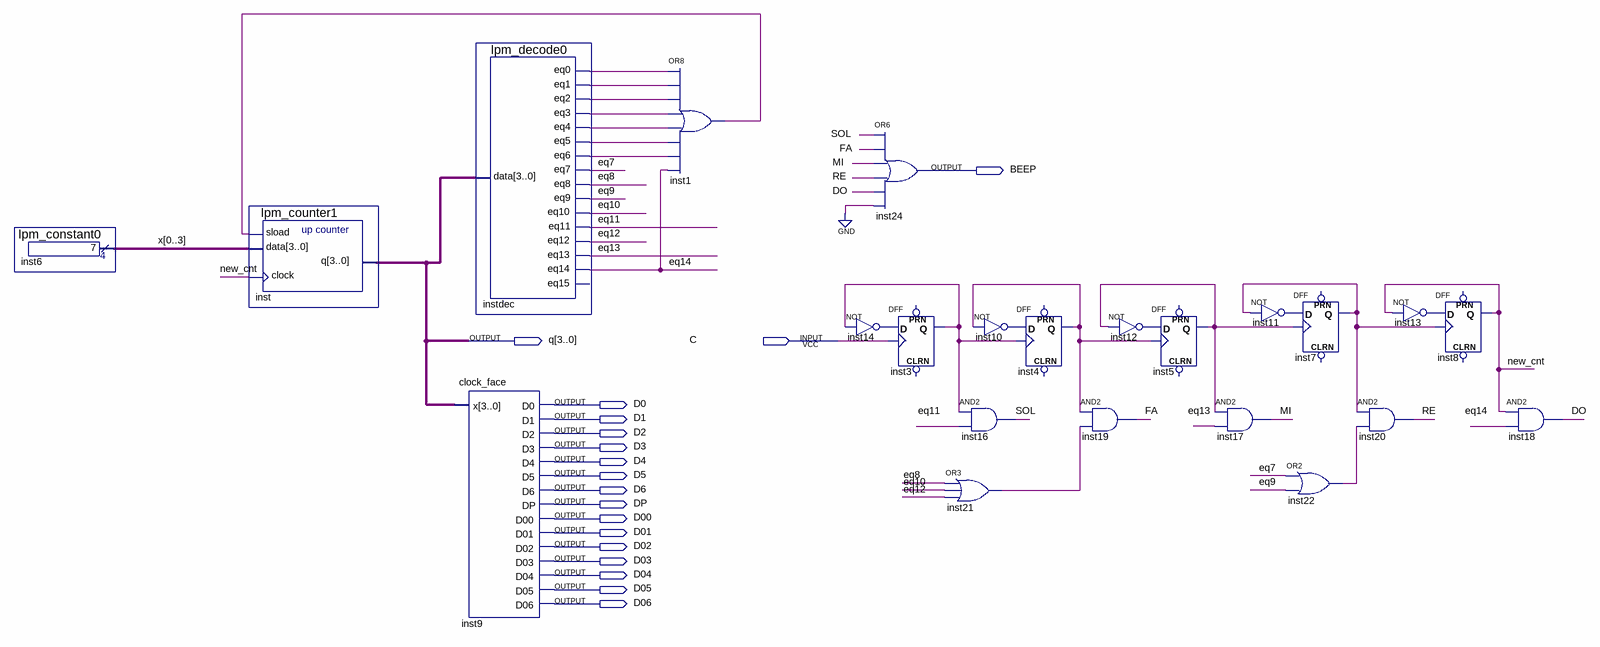
[diagram p0: schematic sheet]
// Quartus schematic 7.bdf as structural Verilog: 23 symbols, 18 pins
module \7  (
  input  C,
  output BEEP,
  output [3:0] q,
  output D0,
  output D1,
  output D2,
  output D3,
  output D4,
  output D5,
  output D6,
  output DP,
  output D00,
  output D01,
  output D02,
  output D03,
  output D04,
  output D05,
  output D06
);

  wire DO, eq7, eq8, eq9, eq10, eq11, eq12, eq13, eq14, FA, inst1_out, inst3_q, inst4_q, inst5_q, inst7_q,
       inst10_out, inst11_out, inst12_out, inst13_out, inst14_out, inst21_out, inst22_out, instdec_eq0,
       instdec_eq1, instdec_eq2, instdec_eq3, instdec_eq4, instdec_eq5, instdec_eq6, MI, new_cnt, RE, SOL;
  wire [3:0] x;

  lpm_constant0 inst6 (.result({x[0], x[1], x[2], x[3]}));
  lpm_counter1 inst (.sload(inst1_out), .data({x[0], x[1], x[2], x[3]}), .clock(new_cnt), .q(q));
  lpm_decode0 instdec (
    .data(q), .eq0(instdec_eq0), .eq1(instdec_eq1), .eq2(instdec_eq2), .eq3(instdec_eq3), .eq4(instdec_eq4),
    .eq5(instdec_eq5), .eq6(instdec_eq6), .eq7(eq7), .eq8(eq8), .eq9(eq9), .eq10(eq10), .eq11(eq11),
    .eq12(eq12), .eq13(eq13), .eq14(eq14));  // open: eq15
  clock_face inst9 (
    .x(q), .D0(D0), .D1(D1), .D2(D2), .D3(D3), .D4(D4), .D5(D5), .D6(D6), .DP(DP), .D00(D00), .D01(D01),
    .D02(D02), .D03(D03), .D04(D04), .D05(D05), .D06(D06));
  or inst1 (inst1_out, instdec_eq0, instdec_eq1, instdec_eq2, instdec_eq3, instdec_eq4, instdec_eq5, instdec_eq6, eq14);
  or inst24 (BEEP, SOL, FA, MI, RE, DO, 1'b0);
  DFF inst3 (.CLK(C), .D(inst14_out), .Q(inst3_q));  // open: CLRN, PRN
  not inst14 (inst14_out, inst3_q);
  or inst21 (inst21_out, eq8, eq10, eq12);
  not inst10 (inst10_out, inst4_q);
  and inst16 (SOL, inst3_q, eq11);
  DFF inst4 (.CLK(inst3_q), .D(inst10_out), .Q(inst4_q));  // open: CLRN, PRN
  not inst12 (inst12_out, inst5_q);
  and inst19 (FA, inst4_q, inst21_out);
  DFF inst5 (.CLK(inst4_q), .D(inst12_out), .Q(inst5_q));  // open: CLRN, PRN
  and inst17 (MI, inst5_q, eq13);
  DFF inst7 (.CLK(inst5_q), .D(inst11_out), .Q(inst7_q));  // open: CLRN, PRN
  not inst11 (inst11_out, inst7_q);
  or inst22 (inst22_out, eq7, eq9);
  not inst13 (inst13_out, new_cnt);
  and inst20 (RE, inst7_q, inst22_out);
  DFF inst8 (.CLK(inst7_q), .D(inst13_out), .Q(new_cnt));  // open: CLRN, PRN
  and inst18 (DO, new_cnt, eq14);
endmodule
